# EAGLE design nonregulation-level-shifter-mk-2.0 (EAGLE 7.5.0)
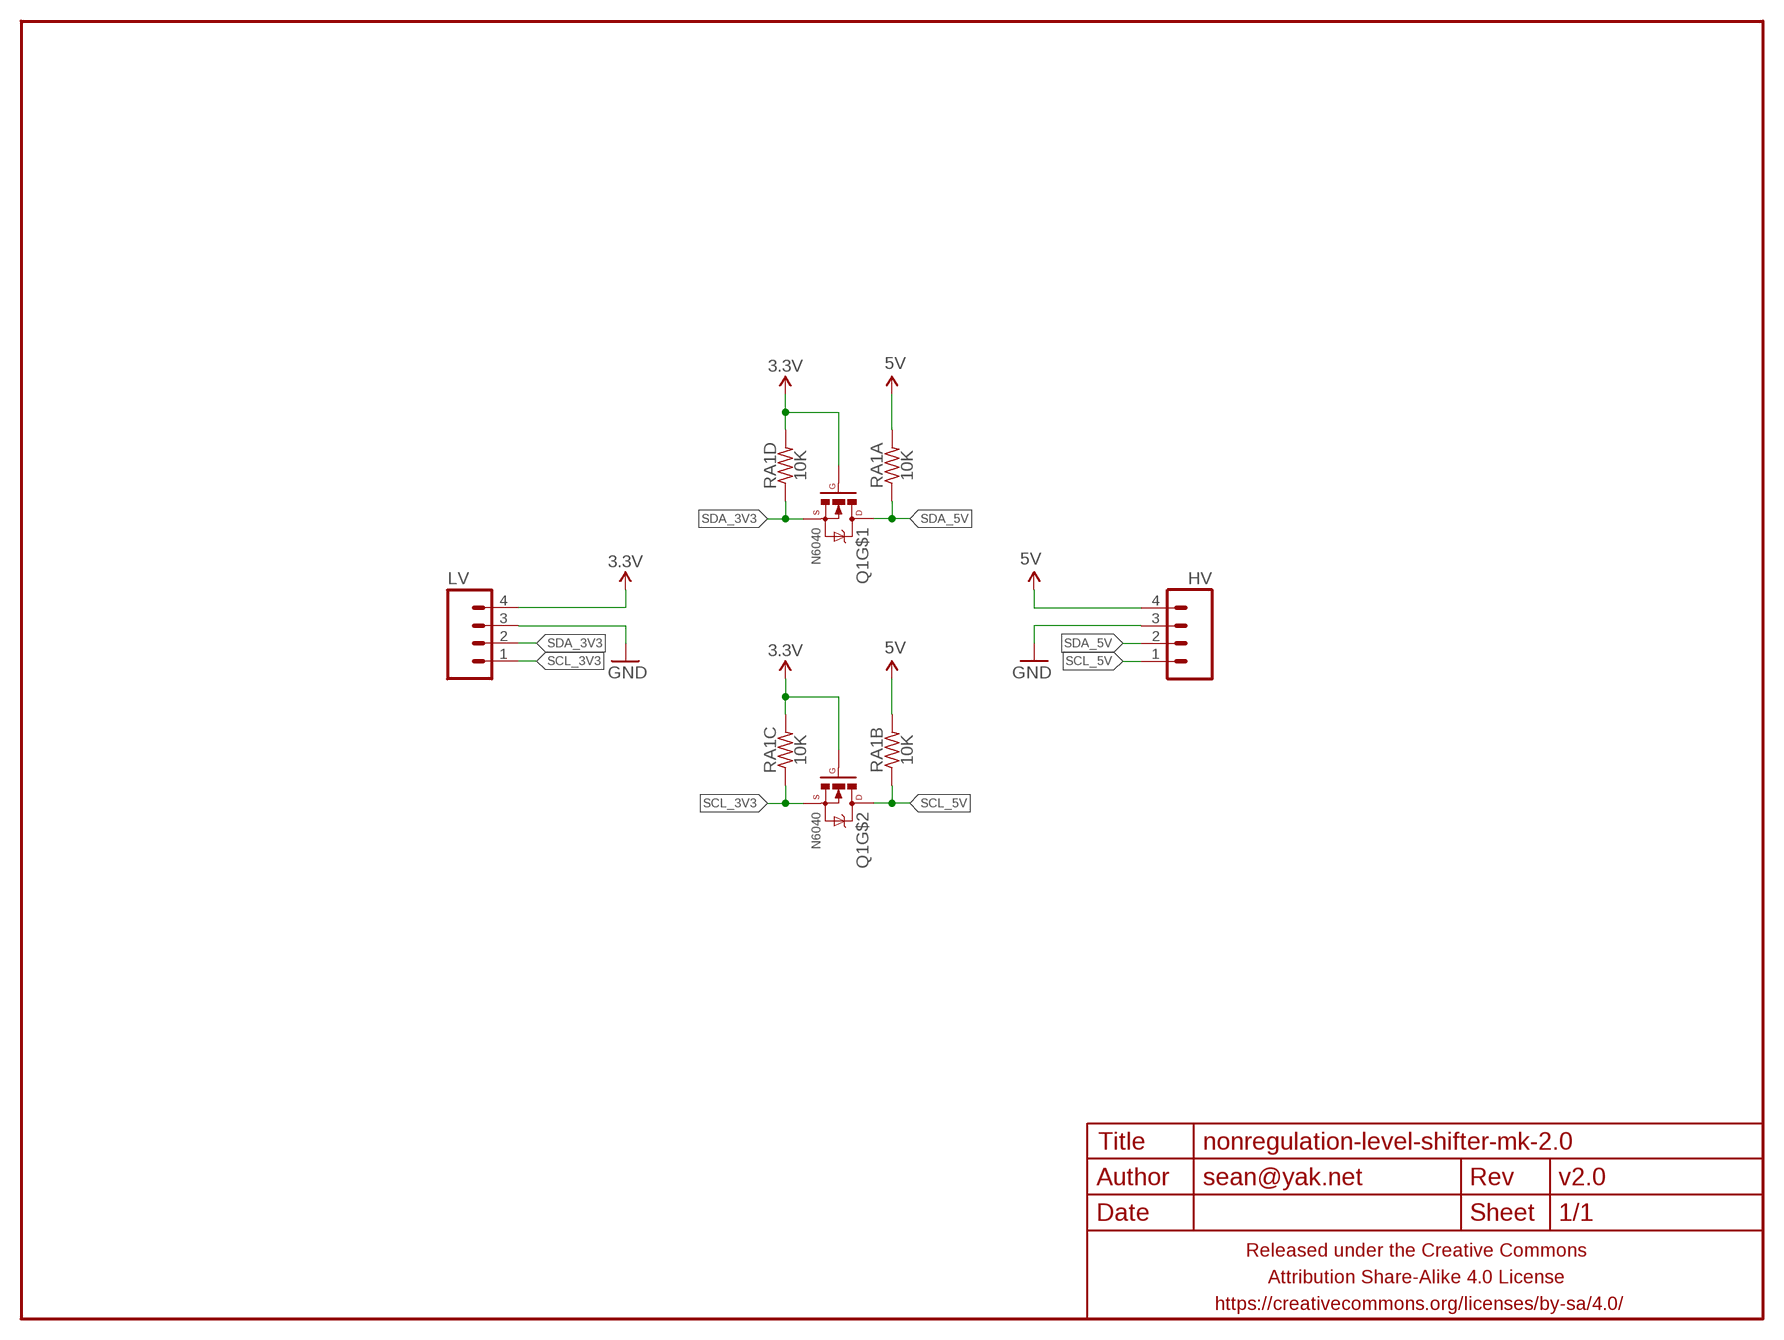
[diagram p0: schematic, sheet 1]

## Parts
FRAME1  FRAME-LETTERNO_PACKAGE  [DUMMY]
HV  M04PTH-CENTERED  [1X04-PTH-VERT-CENTER]
LV  M04PTH-CENTERED  [1X04-PTH-VERT-CENTER]
Q1  N6040  MOSFET-NCHANNEL-DUALSOIC8  [SO08]
RA1  10K  RESISTOR-ARRAY-4YC164  [R1206-ARRAY-4]

## Nets
3.3V: LV.4 Q1.2(G) Q1.4(G) RA1.C2 RA1.D2
5V: HV.4 RA1.A2 RA1.B2
GND: HV.3 LV.3
SCL_3V3: LV.1 Q1.3(S) RA1.C1
SCL_5V: HV.1 Q1.5(D) Q1.6(D) RA1.B1
SDA_3V3: LV.2 Q1.1(S) RA1.D1
SDA_5V: HV.2 Q1.7(D) Q1.8(D) RA1.A1

## Library data of the parts
FRAME1 = A_butts:FRAME-LETTER: Schematic Frame Standard 8.5x11 US Letter frame; DESIGNER: sean@yak.net; VERSION: v2.0
HV LV = a_parts:M04: Header 4 Standard 4-pin 0.1" header. Use with straight break away headers (SKU : PRT-00116), right angle break away headers (PRT-00553), swiss pins (PRT-00743), machine pins (PRT-00117), and female headers (PRT-00115). Molex polarized connector foot print use with SKU : PRT-08231 with associated crimp pins and housings. 1MM SMD Version SKU: PRT-10208
Q1 = a_parts:MOSFET-NCHANNEL-DUAL
RA1 = a_parts:RESISTOR-ARRAY-4

## Board
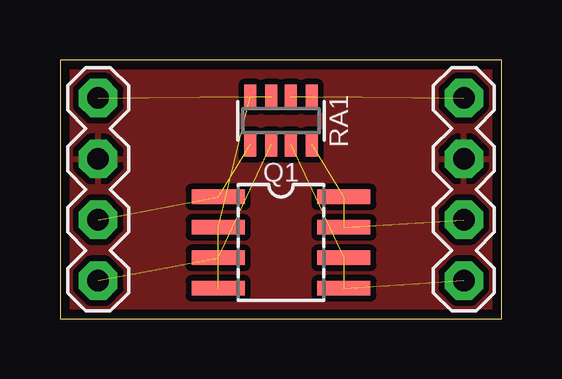
[diagram p1: board, top side]
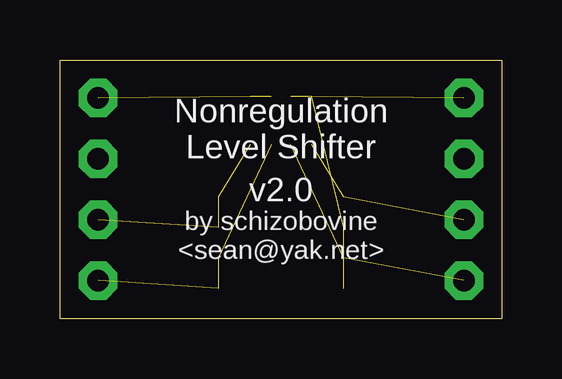
[diagram p2: board, bottom side, seen from below]

Size 18.41 x 10.79 mm. Coordinates in mm from the lower left corner, seen from the top.
Outline: 0,10.79 0,0 18.41,0 18.41,10.79 0,10.79
Copper layers (1*16): Top 0.0356mm / dielectric 1.5011mm / Bottom 0.0356mm
Design rules "LaenPCBOrder_2": minimum track width 6mil, minimum drill 13mil, track to track 6mil, track to pad 6mil, pad to pad 6mil, via to via 6mil, smd to smd 6mil, copper to edge 15mil, drill to drill 6mil, minimum pad ring 7mil, minimum via ring 7mil, stop-mask expansion 3mil, vias tented up to drill 20mil, thermal gap 10mil

### Footprints (pad centres in the part's own frame; a part is rotated, then mirrored left to right if it is on the bottom)
1X04-PTH-VERT-CENTER = drill 0.9 pad 1.6 octagon: 1 -3.81,0; 2 -1.27,0; 3 1.27,0; 4 3.81,0
SO08 = smd 0.61 x 2.21: 1 -1.905,-2.616; 2 -0.635,-2.616; 3 0.635,-2.616; 4 1.905,-2.616; 5 1.905,2.616; 6 0.635,2.616; 7 -0.635,2.616; 8 -1.905,2.616
R1206-ARRAY-4 = smd 0.5 x 1: A1 -1.275,1; A2 -1.272,-1; B1 -0.4,1; B2 -0.4,-1; C1 0.4,1; C2 0.4,-1; D1 1.274,1; D2 1.272,-1

### Placement (x,y rotation side)
FRAME1  0,0 0 top
HV  16.83,5.4 90 top
LV  1.59,5.4 90 top
Q1  9.21,3.17 270 top
RA1  9.21,8.26 180 top

### Tracks (layer width: path | path; a pad name or v marks a point on that pad's centre or on a via)
3.3V  (4 unrouted)
5V  (2 unrouted)
GND
  pour Top (isolate 0.25): 18.41,0 0,0 0,10.79 18.41,10.79
SCL_3V3  (2 unrouted)
SCL_5V  (3 unrouted)
SDA_3V3  (2 unrouted)
SDA_5V  (3 unrouted)

### Text on the board
bPlace: Nonregulation / Level Shifter | by schizobovine / <sean@yak.net>